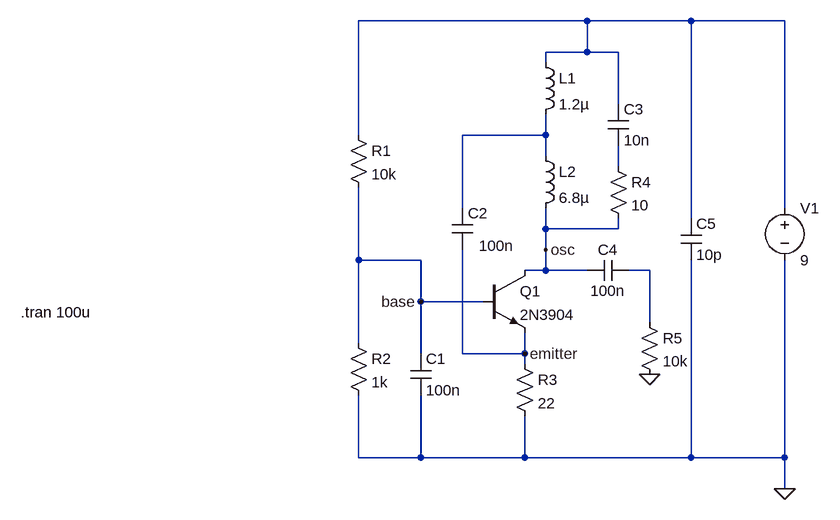
[diagram p0: schematic HartleyOscillator.asc]
HartleyOscillator.asc, the LTspice schematic file:
Version 4
SHEET 1 936 680
WIRE 384 -304 32 -304
WIRE 544 -304 384 -304
WIRE 688 -304 544 -304
WIRE 384 -256 384 -304
WIRE 384 -256 320 -256
WIRE 432 -256 384 -256
WIRE 320 -240 320 -256
WIRE 432 -176 432 -256
WIRE 32 -128 32 -304
WIRE 320 -128 320 -160
WIRE 320 -128 192 -128
WIRE 320 -96 320 -128
WIRE 432 -80 432 -112
WIRE 192 -16 192 -128
WIRE 688 -16 688 -304
WIRE 544 0 544 -304
WIRE 320 16 320 -16
WIRE 432 16 432 0
WIRE 432 16 320 16
WIRE 320 48 320 16
WIRE 32 64 32 -48
WIRE 128 64 32 64
WIRE 320 80 320 48
WIRE 320 80 288 80
WIRE 384 80 320 80
WIRE 480 80 448 80
WIRE 128 128 128 64
WIRE 224 128 128 128
WIRE 480 160 480 80
WIRE 32 192 32 64
WIRE 128 208 128 128
WIRE 192 208 192 48
WIRE 288 208 288 176
WIRE 288 208 192 208
WIRE 288 224 288 208
WIRE 32 368 32 272
WIRE 128 368 128 272
WIRE 128 368 32 368
WIRE 288 368 288 304
WIRE 288 368 128 368
WIRE 544 368 544 64
WIRE 544 368 288 368
WIRE 688 368 688 64
WIRE 688 368 544 368
WIRE 688 416 688 368
FLAG 688 416 0
FLAG 480 240 0
FLAG 320 48 osc
FLAG 288 208 emitter
FLAG 128 128 base
SYMBOL cap 112 208 R0
SYMATTR InstName C1
SYMATTR Value 100n
SYMBOL cap 176 -16 R0
WINDOW 3 41 58 Left 2
SYMATTR Value 100n
SYMATTR InstName C2
SYMBOL cap 416 -176 R0
SYMATTR InstName C3
SYMATTR Value 10n
SYMBOL cap 448 64 R90
WINDOW 0 0 32 VBottom 2
WINDOW 3 32 32 VTop 2
SYMATTR InstName C4
SYMATTR Value 100n
SYMBOL cap 528 0 R0
SYMATTR InstName C5
SYMATTR Value 10p
SYMBOL ind 304 -256 R0
SYMATTR InstName L1
SYMATTR Value 1.2µ
SYMBOL ind 304 -112 R0
SYMATTR InstName L2
SYMATTR Value 6.8µ
SYMBOL res 16 -144 R0
SYMATTR InstName R1
SYMATTR Value 10k
SYMBOL res 16 176 R0
SYMATTR InstName R2
SYMATTR Value 1k
SYMBOL res 272 208 R0
SYMATTR InstName R3
SYMATTR Value 22
SYMBOL npn 224 80 R0
SYMATTR InstName Q1
SYMATTR Value 2N3904
SYMBOL voltage 688 -32 R0
WINDOW 123 0 0 Left 0
WINDOW 39 0 0 Left 0
SYMATTR InstName V1
SYMATTR Value 9
SYMBOL res 416 -96 R0
SYMATTR InstName R4
SYMATTR Value 10
SYMBOL res 464 144 R0
SYMATTR InstName R5
SYMATTR Value 10k
TEXT -488 144 Left 2 !.tran 100u

The netlist it stands for:
* HartleyOscillator.asc
C1 base 0 100n
C2 N002 emitter 100n
C3 N001 N003 10n
C4 N004 osc 100n
C5 N001 0 10p
L1 N001 N002 1.2µ
L2 N002 osc 6.8µ
R1 N001 base 10k
R2 base 0 1k
R3 emitter 0 22
Q1 osc base emitter 0 2N3904
V1 N001 0 9
R4 N003 osc 10
R5 N004 0 10k
.model NPN NPN
.model PNP PNP
.lib standard.bjt
.tran 100u
.backanno
.end